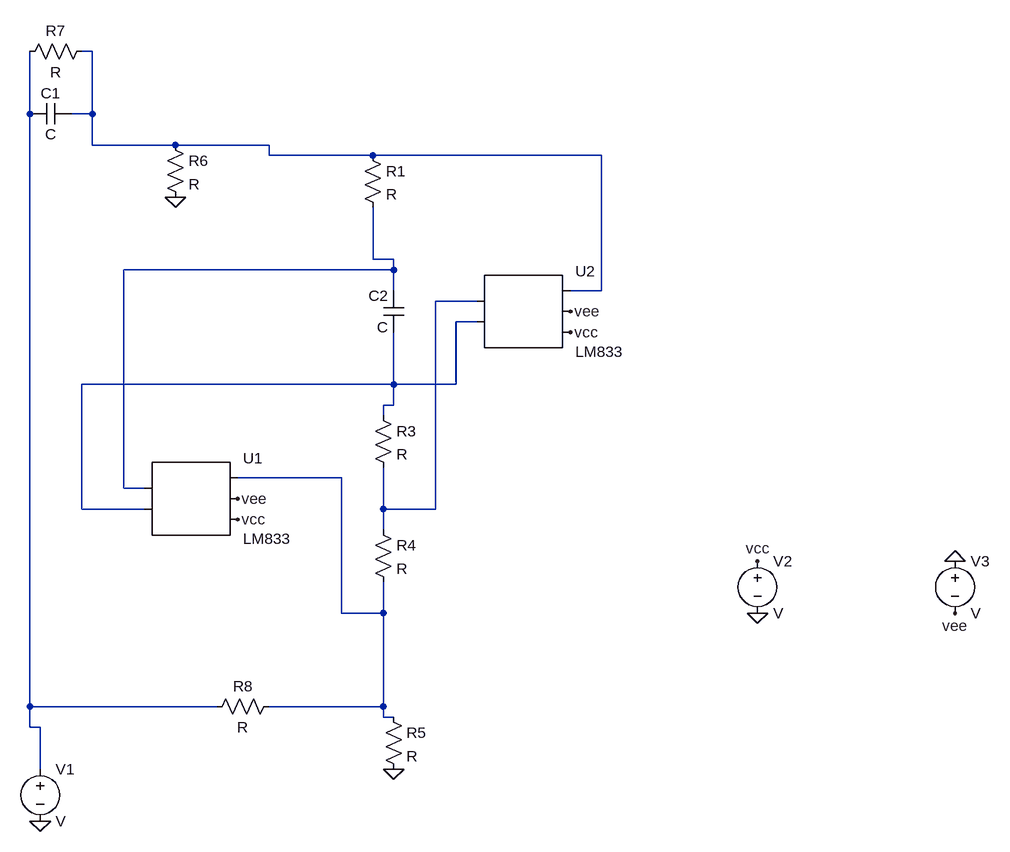
[diagram p0: schematic Draft1.asc]
Draft1.asc, the LTspice schematic file:
Version 4
SHEET 1 1032 740
WIRE -352 -464 -368 -464
WIRE -448 -368 -448 -464
WIRE -352 -368 -352 -464
WIRE -352 -368 -384 -368
WIRE -352 -320 -352 -368
WIRE -224 -320 -352 -320
WIRE -80 -320 -224 -320
WIRE -80 -304 -80 -320
WIRE 80 -304 -80 -304
WIRE 432 -304 80 -304
WIRE 80 -144 80 -224
WIRE 112 -144 80 -144
WIRE 112 -128 112 -144
WIRE 112 -128 -304 -128
WIRE 112 -96 112 -128
WIRE 432 -96 432 -304
WIRE 432 -96 384 -96
WIRE 240 -80 176 -80
WIRE 240 -48 208 -48
WIRE 112 48 112 -32
WIRE 112 48 -368 48
WIRE 208 48 208 -48
WIRE 208 48 112 48
WIRE 112 80 112 48
WIRE 112 80 96 80
WIRE 96 96 96 80
WIRE 32 192 -128 192
WIRE -304 208 -304 -128
WIRE -272 208 -304 208
WIRE -368 240 -368 48
WIRE -272 240 -368 240
WIRE 96 240 96 176
WIRE 176 240 176 -80
WIRE 176 240 96 240
WIRE 96 272 96 240
WIRE 32 400 32 192
WIRE 96 400 96 352
WIRE 96 400 32 400
WIRE -448 544 -448 -368
WIRE -160 544 -448 544
WIRE 96 544 96 400
WIRE 96 544 -80 544
WIRE 96 560 96 544
WIRE 112 560 96 560
WIRE -448 576 -448 544
WIRE -432 576 -448 576
WIRE -432 640 -432 576
FLAG -224 -240 0
FLAG 112 640 0
FLAG -432 720 0
FLAG -128 224 vee
FLAG 384 -32 vcc
FLAG -128 256 vcc
FLAG 384 -64 vee
FLAG 672 320 vcc
FLAG 672 400 0
FLAG 976 320 0
FLAG 976 400 vee
SYMBOL AutoGenerated\\LM833 304 -64 R0
SYMATTR InstName U2
SYMBOL AutoGenerated\\LM833 -208 224 R0
SYMATTR InstName U1
SYMBOL res 64 -320 R0
SYMATTR InstName R1
SYMBOL res 80 80 R0
SYMATTR InstName R3
SYMBOL res 80 256 R0
SYMATTR InstName R4
SYMBOL res 96 544 R0
SYMATTR InstName R5
SYMBOL res -240 -336 R0
SYMATTR InstName R6
SYMBOL res -352 -480 R90
WINDOW 0 0 56 VBottom 2
WINDOW 3 32 56 VTop 2
SYMATTR InstName R7
SYMBOL res -64 528 R90
WINDOW 0 0 56 VBottom 2
WINDOW 3 32 56 VTop 2
SYMATTR InstName R8
SYMBOL cap -384 -384 R90
WINDOW 0 0 32 VBottom 2
WINDOW 3 32 32 VTop 2
SYMATTR InstName C1
SYMBOL cap 128 -32 R180
WINDOW 0 24 56 Left 2
WINDOW 3 24 8 Left 2
SYMATTR InstName C2
SYMBOL voltage -432 624 R0
SYMATTR InstName V1
SYMBOL voltage 672 304 R0
SYMATTR InstName V2
SYMBOL voltage 976 304 R0
SYMATTR InstName V3

The netlist it stands for:
* Draft1.asc
* U2: LM833 (symbol AutoGenerated\LM833 not available, pins judged from their places): pin1=N004 pin2=N005 pin3=N001 pin4=vee pin5=vcc
* U1: LM833 (symbol AutoGenerated\LM833 not available, pins judged from their places): pin1=N003 pin2=N005 pin3=N006 pin4=vee pin5=vcc
R1 N001 N003 R
R3 N005 N004 R
R4 N004 N006 R
R5 N006 0 R
R6 N001 0 R
R7 N001 N002 R
R8 N006 N002 R
C1 N001 N002 C
C2 N005 N003 C
V1 N002 0 V
V2 vcc 0 V
V3 0 vee V
.backanno
.end